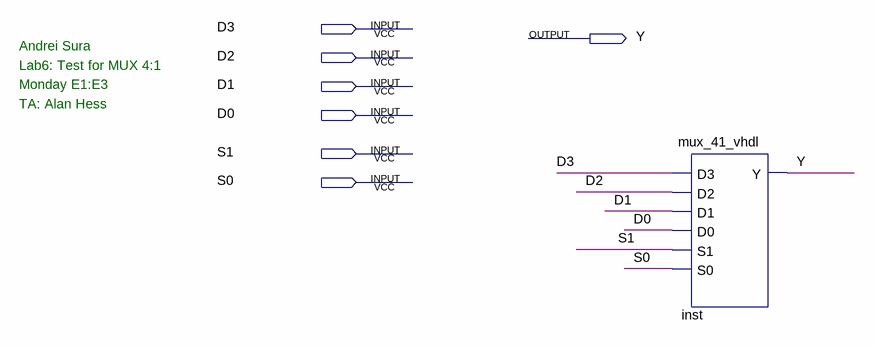
[diagram p0: schematic sheet]
// Quartus schematic mux_41_vhdl_test.bdf as structural Verilog: 1 symbols, 7 pins
module mux_41_vhdl_test (
  input  D3,
  input  D2,
  input  D1,
  input  D0,
  input  S1,
  input  S0,
  output Y
);

  mux_41_vhdl inst (.D3(D3), .D2(D2), .D1(D1), .D0(D0), .S1(S1), .S0(S0), .Y(Y));

  // Notes on the sheet:
  //   Andrei Sura
  //   Lab6: Test for MUX 4:1
  //   Monday E1:E3
  //   TA: Alan Hess
endmodule
